# Altium schematic sheet Sheet1.SchDoc
size A4; SheetNumber: 3; SheetTotal: 3
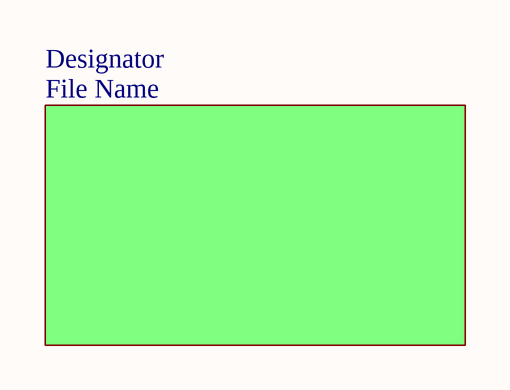
[diagram p0: Sheet1.SchDoc]

## Sub-sheets
Designator = File Name: no entries